# Altium schematic sheet ADC.SchDoc: 24-bit Analog to Digital converter
size A4; Author: Grzegorz Gajoch; DocumentNumber: 7; SheetNumber: 7; SheetTotal: 16; Model: EM1; PageSetup: Record=PageOptions|CenterHorizontal=True|CenterVertical=True|PrintScale=0.52|XCorrection=1.00|YCorrection=1.00|PrintKind=1|BorderSize=5000000|LeftOffset=0|BottomOffset=0|Orientation=2|PaperLength=4200|PaperWidth=2970|Scale=100|PaperSource=7|PrintQuality=600|MediaType=1|DitherType=10|PaperKind=A3|PrintScaleMode=1
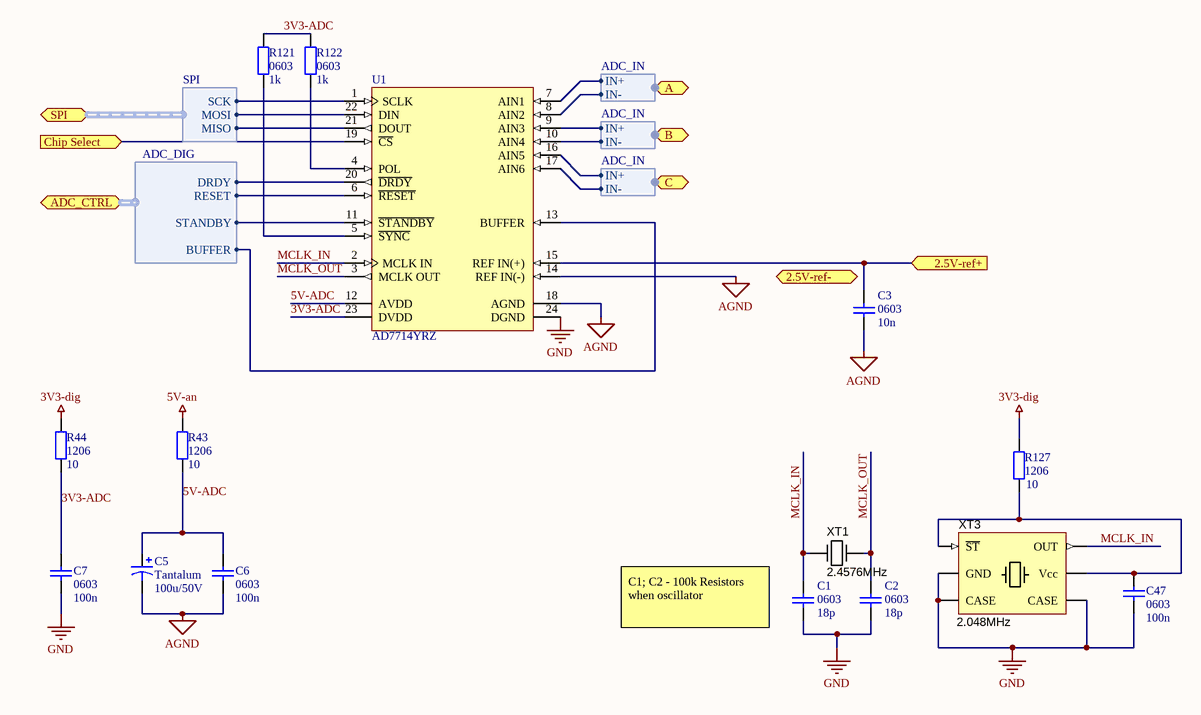
[diagram p0: ADC.SchDoc]

## Parts
C1  0603  value 18p  [SMD_Capacitor_0603]
C2  0603  value 18p  [SMD_Capacitor_0603]
C3  0603  value 10n  [SMD_Capacitor_0603]
C5  Tantalum  value 100u/50V  [Tantalum_cap_D]
C6  0603  value 100n  [SMD_Capacitor_0603]
C7  0603  value 100n  [SMD_Capacitor_0603]
C47  0603  value 100n  [SMD_Capacitor_0603]
R43  1206  value 10  [SMD_Resistor_1206]
R44  1206  value 10  [SMD_Resistor_1206]
R121  0603  value 1k  [SMD_Resistor_0603]
R122  0603  value 1k  [SMD_Resistor_0603]
R127  1206  value 10  [SMD_Resistor_1206]
U1  AD7714YRZ  [RW-24_M]
XT1  2.4576MHz  [HC49U]
XT3  2.048MHz  [SG7050]

## Ports
2.5V-ref+ (in), 2.5V-ref- (out), A (harness ADC_IN), ADC_CTRL (harness ADC_DIG), B (harness ADC_IN), C (harness ADC_IN), Chip Select (in), SPI (harness SPI)

## Harnesses
ADC_DIG: DRDY, RESET, STANDBY, BUFFER
ADC_IN: IN+, IN-
SPI: MOSI, MISO, SCK

## Nets
3V3-dig: R44.1 R127.2
5V-an: R43.1
AGND: C3.1 C5.2 C6.1 U1.14(REF_IN(-)) U1.18(AGND)
GND: C1.1 C2.1 C7.1 C47.2 U1.24(DGND) XT3.2(CASE) XT3.3(GND) XT3.5(CASE)
2.5V-ref+: C3.2 U1.15(REF_IN(+)) ; port 2.5V-ref+
3V3-ADC: C7.2 R44.2 R121.1 R122.1 U1.23(DVDD)
5V-ADC: C5.1 C6.2 R43.2 U1.12(AVDD)
Chip Select: U1.19(~{CS}) ; port Chip Select
MCLK_IN: C1.2 U1.2(MCLK_IN) XT1.1(IN) XT3.4(OUT)
MCLK_OUT: C2.2 U1.3(MCLK_OUT) XT1.2(OUT)
NetC47_1: C47.1 R127.1 XT3.1(~{ST}) XT3.6(Vcc)
NetR121_2: R121.2 U1.5(~{SYNC})
NetR122_2: R122.2 U1.4(POL)
NetU1_1: U1.1(SCLK) ; port SPI.SCK
NetU1_6: U1.6(~{RESET}) ; port ADC_CTRL.RESET
NetU1_7: U1.7(AIN1) ; port A.IN+
NetU1_8: U1.8(AIN2) ; port A.IN-
NetU1_9: U1.9(AIN3) ; port B.IN+
NetU1_10: U1.10(AIN4) ; port B.IN-
NetU1_11: U1.11(~{STANDBY}) ; port ADC_CTRL.STANDBY
NetU1_13: U1.13(BUFFER) ; port ADC_CTRL.BUFFER
NetU1_16: U1.16(AIN5) ; port C.IN+
NetU1_17: U1.17(AIN6) ; port C.IN-
NetU1_20: U1.20(~{DRDY}) ; port ADC_CTRL.DRDY
NetU1_21: U1.21(DOUT) ; port SPI.MISO
NetU1_22: U1.22(DIN) ; port SPI.MOSI

## Notes on the sheet
- (near C1) C1; C2 - 100k Resistors when oscillator
- Title:
- Sheet:
- of
- Author:
- Model:
- Document Number:
- Checked by:
- Iss-Rev:
- Approved by:
- Date:
- File name:

## Library data of the parts
C1-C3 C6 C7 C47 = Cap1: Capacitor; Published: 8-Jun-2000; LatestRevisionDate: 17-Jul-2002; LatestRevisionNote: Re-released for DXP Platform.; PackageReference: RAD-0.3; Publisher: Altium Limited; PackageDescription: Radial Cap, Thru-Hole; 2 Leads; 0.3 in Pin Spacing
C5 = Cap Pol1: Polarized Capacitor (Radial); Published: 8-Jun-2000; LatestRevisionDate: 17-Jul-2002; LatestRevisionNote: Re-released for DXP Platform.; PackageReference: RB7.6-15; Publisher: Altium Limited; PackageDescription: Polarized Capacitor (Radial); 2 Leads
R43 R44 R121 R122 R127 = Res2: Resistor; Published: 8-Jun-2000; LatestRevisionDate: 17-Jul-2002; LatestRevisionNote: Re-released for DXP Platform.; PackageReference: AXIAL-0.4; Publisher: Altium Limited; PackageDescription: Axial Device, Thru-Hole; 2 Leads; 0.4 in Pin Spacing
U1 = AD7714YRZ: 5 Channel 24-Bit Signal Conditioning Analog-to-Digital Converter with Serial, SPI Interface, 500 uA, CMOS, 3 V / 5 V, 1KSPS, -40 to +105 degC, RW-24, Pb-Free, Tube; Generic Part Number: AD7714; Manufacturer: Analog Devices; Resolution (Bits): 24; Channels: 5; Throughput Rate (SPS): 1K; Interface: Ser, SPI; DatasheetVersion: Rev.C; PackageVersion: 060706-A; PackageReference: RW-24; PackageDescription: 24-Lead Standard Small Outline Package [SOIC_W]; Supplier 1: Digi-Key; Supplier Part Number 1: AD7714YRZ-ND; Supplier 2: Farnell; Supplier Part Number 2: 1438858; Supplier 3: Newark; Supplier Part Number 3: 15P0854; Supplier 4: Newark; Supplier Part Number 4: 59K5335; Supplier 5: Mouser; Supplier Part Number 5: 584-AD7714YRZ; RoHS: Y; Packing: Tube; Mounting Technology: Surface Mount; Code_JEDEC: MS-013-AD; PartNumber: AD7714YRZ; ComponentLink1Description: Manufacturer URL; ComponentLink1URL: http://www.analog.com/en/index.html; ComponentLink2Description: Datasheet; ComponentLink2URL: http://www.analog.com/static/imported-files/data_sheets/AD7714.pdf; ComponentLink3Description: Package Specification; ComponentLink3URL: http://www.analog.com/static/imported-files/packages/33665150946139RW_24.pdf; ComponentLink4Description: Product URL; ComponentLink4URL: http://www.analog.com/en/analog-to-digital-converters/ad-converters/ad7714/products/product.html
XT1 = Crystal: AKER  C-2.4576-18-3050-X; Manufacturer 1: Citizen Finetech Miyota; Manufacturer Part Number 1: CMR309T-6.000MABJ-UT; Ratings: 6.00 MHz; Frequency: 6MHz; Frequency Stability: ±50ppm; Frequency Tolerance: ±30ppm; Load Capacitance: 18pF; Operating Mode: Fundamental; SCDType: spec; Package / Case: Cylindrical Can, Radial; Type: MHz Crystal; Operating Temperature: -10°C ~ 60°C; Mounting Type: Surface Mount; Size / Dimension: 0.118" Dia x 0.346" L (3.00mm x 8.80mm); Height: 0.122" (3.10mm); Supplier 1: Digi-Key; Supplier Part Number 1: 300-8348-1-ND; Tolerance: ±50ppm; ComponentLink1URL: http://media.digikey.com/pdf/Data%20Sheets/Citizen%20PDFs/CMR310T%20CMR309T.pdf; ComponentLink1Description: http://media.digikey.com/pdf/Data%20Sheets/Citizen%20PDFs/CMR310T%20CMR309T.pdf; Value: 2.4576MHz
XT3 = Crystal Oscillator: Manufacturer 1: Citizen Finetech Miyota; Manufacturer Part Number 1: CMR309T-6.000MABJ-UT; Ratings: 6.00 MHz; Frequency Stability: ±50ppm; Frequency Tolerance: ±30ppm; Load Capacitance: 15pF max.; Operating Mode: Fundamental; SCDType: spec; Package / Case: Cylindrical Can, Radial; Type: MHz Crystal; Frequency: 2.048MHz; Operating Temperature: -10°C ~ 60°C; Mounting Type: Surface Mount; Size / Dimension: 0.118" Dia x 0.346" L (3.00mm x 8.80mm); Height: 0.122" (3.10mm); Supplier 1: Digi-Key; Supplier Part Number 1: 300-8348-1-ND; Tolerance: ±50ppm; ComponentLink1URL: http://www.farnell.com/datasheets/1841779.pdf; ComponentLink1Description: http://pl.farnell.com/epson/x1g0044810050-sg7050can-2-048-mhz/oscillator-spxo-sg7050can-2-048/dp/2442953; Value: 2.048MHz